# Altium project Amplifecation.PrjPCB
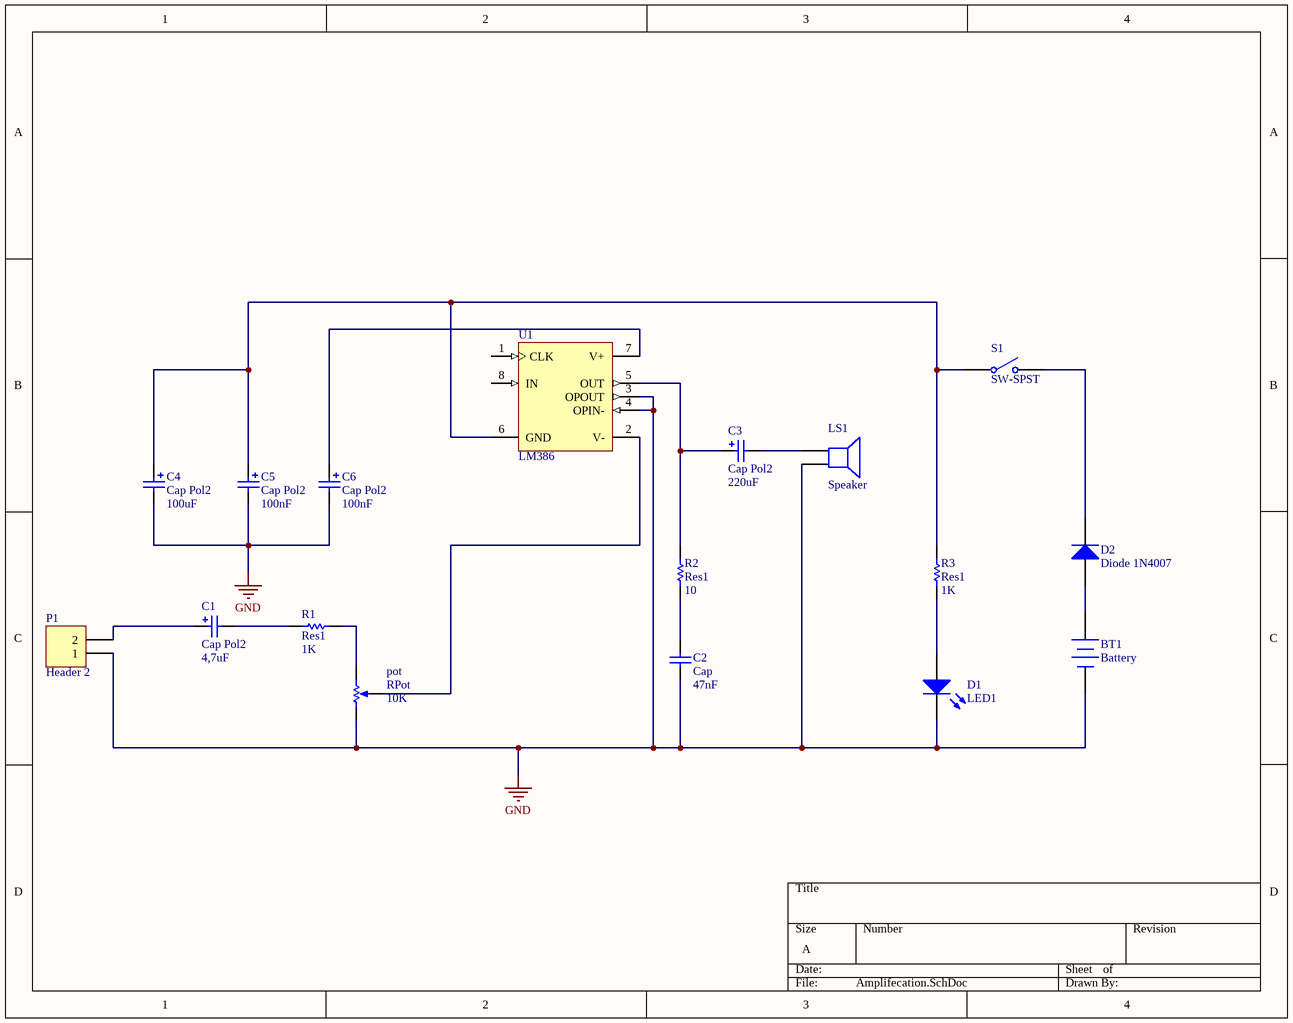
[diagram p0: Amplifecation.SchDoc]
1 sheet, 17 parts. Net scope: global (net labels, ports and power ports of the same name join across sheets).
Board file: Amplifecation.PcbDoc

## Sheet Amplifecation.SchDoc
size A

### Parts
BT1  Battery  [BAT-2]
C1  Cap Pol2  value 4,7uF  [POLAR0.8]
C2  Cap  value 47nF  [RAD-0.3]
C3  Cap Pol2  value 220uF  [POLAR0.8]
C4  Cap Pol2  value 100uF  [POLAR0.8]
C5  Cap Pol2  value 100nF  [POLAR0.8]
C6  Cap Pol2  value 100nF  [POLAR0.8]
D1  LED1  [LED-1]
D2  Diode 1N4007  [DO-41]
LS1  Speaker  [PIN2]
P1  Header 2  [HDR1X2]
pot  RPot  value 10K  [VR5]
R1  Res1  value 1K  [AXIAL-0.3]
R2  Res1  value 10  [AXIAL-0.3]
R3  Res1  value 1K  [AXIAL-0.3]
S1  SW-SPST  [SPST-2]
U1  LM386  [PA8]

### Nets
GND: BT1.2(-) C2.1 C4.2 C5.2 C6.2 D1.2(K) LS1.2 P1.1 pot.1(TOP) U1.3(OPOUT) U1.4(OPIN-)
NetBT1_1: BT1.1(+) D2.1(A)
NetC1_1: C1.1 P1.2
NetC1_2: C1.2 R1.1
NetC2_2: C2.2 R2.1
NetC3_1: C3.1 R2.2 U1.5(OUT)
NetC3_2: C3.2 LS1.1
NetC4_1: C4.1 C5.1 R3.2 S1.1(COMMON) U1.6(GND)
NetC6_1: C6.1 U1.7(V+)
NetD1_1: D1.1(A) R3.1
NetD2_2: D2.2(K) S1.2(NO)
Netpot_2: pot.2(BOT) R1.2
Netpot_3: pot.3(TAP) U1.2(V-)

Not connected (* = marked no-connect by the designer): U1 1(CLK) 8(IN)

### Library data of the parts
BT1 = Battery: Multicell Battery; Published: 24-Mar-1999; LatestRevisionDate: 17-Jul-2002; LatestRevisionNote: Re-released for DXP Platform.; PackageReference: BAT-2; Publisher: Altium Limited; PackageDescription: Battery; 2 Leads
C1 C3-C6 = Cap Pol2: Polarized Capacitor (Axial); Published: 8-Jun-2000; LatestRevisionDate: 17-Jul-2002; LatestRevisionNote: Re-released for DXP Platform.; PackageReference: POLAR0.8; Publisher: Altium Limited; PackageDescription: Polarized Capacitor; 2 Leads
C2 = Cap: Capacitor; Published: 8-Jun-2000; LatestRevisionDate: 17-Jul-2002; LatestRevisionNote: Re-released for DXP Platform.; PackageReference: RAD-0.3; Publisher: Altium Limited; PackageDescription: Radial Cap, Thru-Hole; 2 Leads; 0.3 in Pin Spacing
D1 = LED1: Typical RED GaAs LED; Published: 8-Jun-2000; LatestRevisionDate: 08-Jul-2005; LatestRevisionNote: Mech Layer 1 removed.; PackageReference: LED-1; Publisher: Altium Limited; PackageDescription: LED; 2 Leads
D2 = Diode 1N4007: 1 Amp General Purpose Rectifier; Published: 8-Jun-2000; LatestRevisionDate: 17-Jul-2002; LatestRevisionNote: Re-released for DXP Platform.; DatasheetVersion: 1998; PackageVersion: Aug-1999; PackageReference: DO-41; Publisher: Altium Limited; PackageDescription: Diode, Axial; Body 5.2 x 2.7 mm (LxDia. max), Lead Dia. 0.86 mm (max); Code_JEDEC: DO-204-AL; ComponentLink1Description: Manufacturer Link; ComponentLink1URL: http://www.fairchildsemi.com/; ComponentLink2Description: Datasheet; ComponentLink2URL: http://www.fairchildsemi.com/ds/1N%2F1N4001.pdf
LS1 = Speaker: Loudspeaker; Published: 24-Mar-1999; LatestRevisionDate: 17-Jul-2002; LatestRevisionNote: Re-released for DXP Platform.; PackageReference: PIN2; Publisher: Altium Limited
P1 = Header 2: Header, 2-Pin; LatestRevisionDate: 17-Jul-2002; LatestRevisionNote: Re-released for DXP Platform.; Publisher: Altium Limited
pot = RPot: Potentiometer; Sim Note: Enter the Resistance value and the set point into parameter fields.; Set Position: 0.5; Published: 8-Jun-2000; LatestRevisionDate: 17-Jul-2002; LatestRevisionNote: Re-released for DXP Platform.; PackageReference: VR5; Publisher: Altium Limited; PackageDescription: Variable Resistor, Thru-Hole; 3 Leads
R1-R3 = Res1: Resistor; Published: 8-Jun-2000; LatestRevisionDate: 17-Jul-2002; LatestRevisionNote: Re-released for DXP Platform.; PackageReference: AXIAL-0.3; Publisher: Altium Limited; PackageDescription: Axial Device, Thru-Hole; 2 Leads; 0.3 in Pin Spacing
S1 = SW-SPST: Single-Pole, Single-Throw Switch; Published: 24-Mar-1999; LatestRevisionDate: 17-Jul-2002; LatestRevisionNote: Re-released for DXP Platform.; PackageReference: SPST-2; Publisher: Altium Limited; PackageDescription: Switch; 2 Leads
U1 = MAX291CPA: 8th-Order, Lowpass, Switched-Capacitor Filter; Published: 16-Jan-2001; LatestRevisionDate: 29-May-2009; LatestRevisionNote: Component Body Added.; DatasheetVersion: Dec-1996; PackageVersion: RevB, 21-0043; PackageReference: PA8; Publisher: Altium Limited; PackageDescription: DIP, 8-Pin, Row Spacing 7.62 mm, Pitch 2.54 mm; Code_JEDEC: MS-001-AB; ComponentLink1Description: Manufacturer Link; ComponentLink1URL: http://www.maxim-ic.com/; ComponentLink2Description: Datasheet; ComponentLink2URL: http://pdfserv.maxim-ic.com/en/ds/MAX291-MAX296.pdf